# Altium schematic sheet UTHP Power Supply and PLC.SchDoc: Ultimate Truck Hacking Platform
size Letter; Author: Dr. Jeremy Daily; Organization: Systems Cyber Research Group; Address2: Thomas Balzer; Address3: Carson Green; DocumentNumber: Power, LIN, Logic Buffer; Revision: 1; SheetNumber: 4; SheetTotal: 6
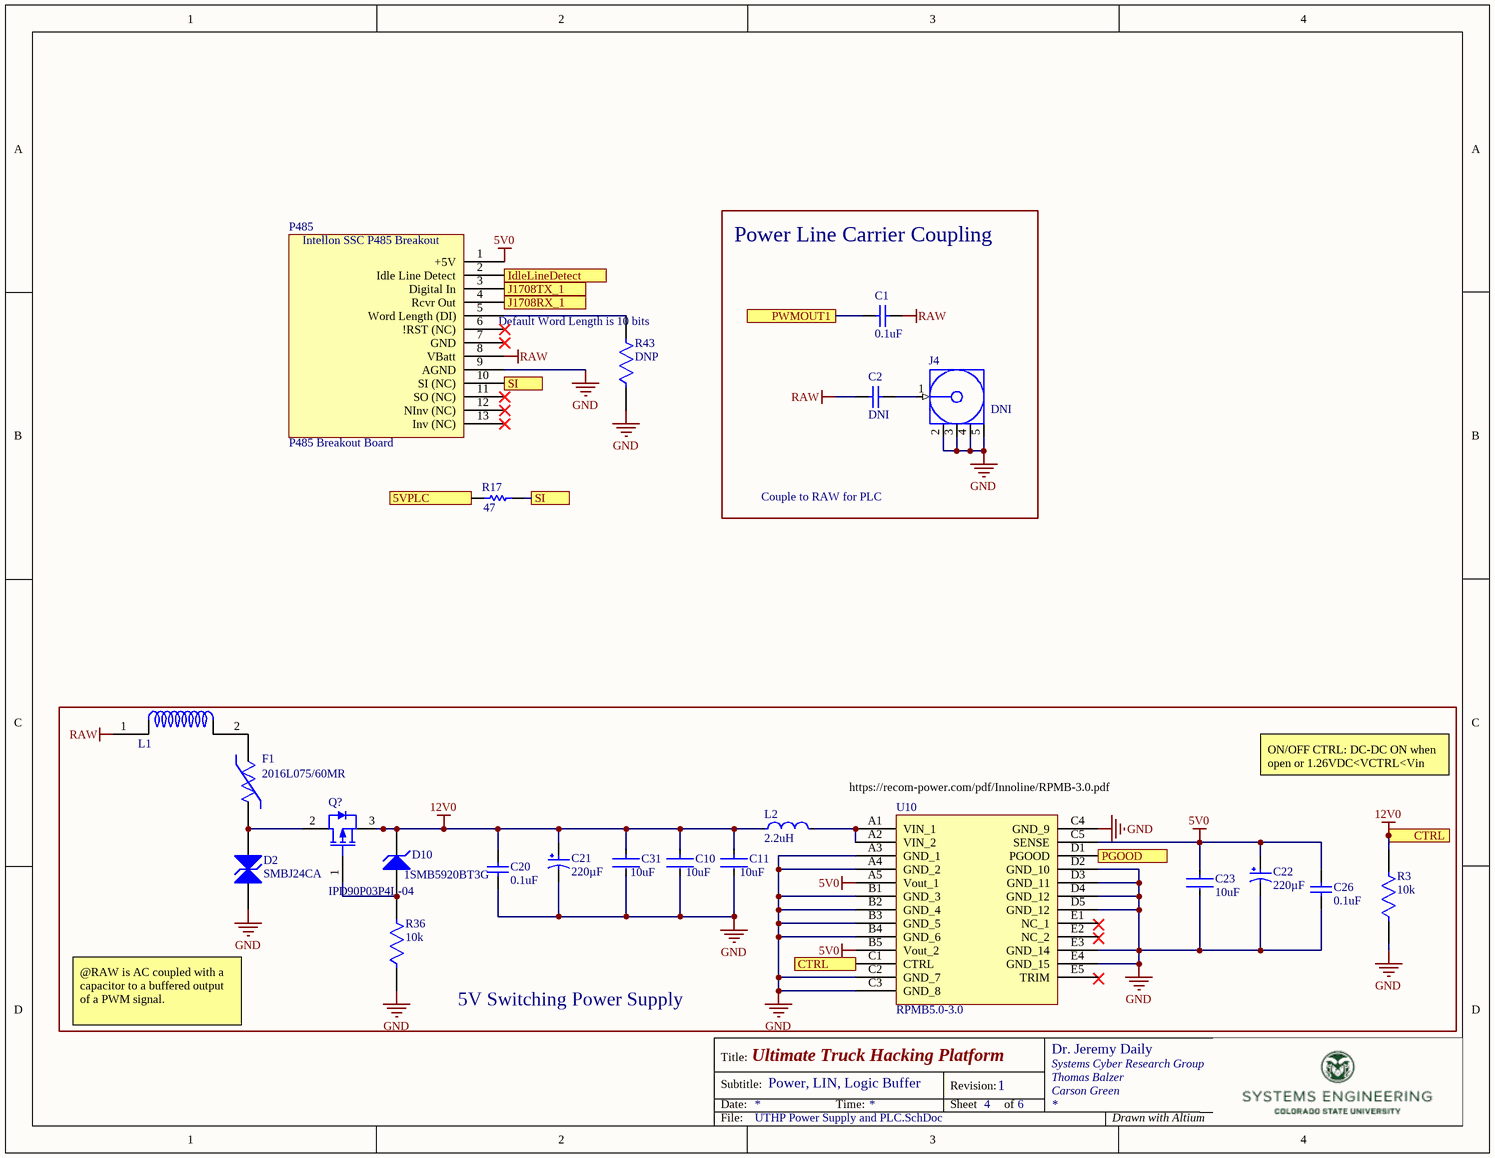
[diagram p0: UTHP Power Supply and PLC.SchDoc]

## Parts
C1  0.1uF  [CAPC1608X90X35LL15T15]
C2  DNI  [CAPC1608X90X35LL15T15]
C10  10uF  [FP-MK325A-MFG]
C11  10uF  [FP-MK325A-MFG]
C20  0.1uF  [CAPC1608X90X35LL15T15]
C21  value 220µF  [CAPPR65-500-1250X1000X1350]  (hidden comment: ECA-1HM221)
C22  value 220µF  [CAPPR65-500-1250X1000X1350]  (hidden comment: ECA-1HM221)
C23  10uF  [FP-MK325A-MFG]
C26  0.1uF  [CAPC1608X90X35LL15T15]
C31  10uF  [FP-MK325A-MFG]
D2  SMBJ24CA  [VISH-DO-214AA-A-2_V]
D10  1SMB5920BT3G  [ONSC-SMB-2-403A-03_H_V]
F1  2016L075/60MR  [FP-2016L075-60MR-MFG]
J4  DNI  [CON-SMA-SMD-RA]
L1  VSAB1770-560M  [VSAB1770-560M-Footprint-1]  (value not drawn)
L2  2.2uH  [FP-LQM2HPN_G0-IPC_C]
P485  P485 Breakout Board  [P485 Breakout Board-Footprint-1]
Q?  IPD90P03P4L-04  [INF-PG-TO252-3-11_M]
R3  10k  [FP-KTR03-IPC_B]
R17  47  [RESC1609X50X30LL10T20]
R36  10k  [FP-KTR03-IPC_B]
R43  DNP  [FP-KTR03-IPC_B]
U10  RPMB5.0-3.0  [New footprint 1]

## Blocks framed on the sheet
Power Line Carrier Coupling: C1 C2 J4
5V Switching Power Supply: C10 C11 C20-C23 C26 C31 D2 D10 F1 L1 L2 Q? R3 R36 U10

## Ports
5VPLC, CTRL, IdleLineDetect, J1708RX_1, J1708TX_1, PGOOD, PWMOUT1, SI

## Nets
5V0: C22.1 C23.1 C26.1 P485.1(+5V) U10.A5(Vout_1) U10.B5(Vout_2) U10.C5(SENSE)
12V0: C10.1 C11.1 C20.1 C21.1 C31.1 D10.1(K) L2.1 Q?.3(SOURCE) R3.2 U10.C1(CTRL) ; port CTRL
GND: C10.2 C11.2 C20.2 C21.2 C22.2 C23.2 C26.2 C31.2 D2.1(A) J4.2(GND) J4.3(GND) J4.4(GND) J4.5(GND) P485.9(AGND) R3.1 R36.1 R43.1 U10.A3(GND_1) U10.A4(GND_2) U10.B1(GND_3) U10.B2(GND_4) U10.B3(GND_5) U10.B4(GND_6) U10.C2(GND_7) U10.C3(GND_8) U10.C4(GND_9) U10.D2(GND_10) U10.D3(GND_11) U10.D4(GND_12) U10.D5(GND_12) U10.E3(GND_14) U10.E4(GND_15)
RAW: C1.1 C2.2 L1.1 P485.8(VBatt)
5VPLC: R17.1 ; port 5VPLC
IdleLineDetect: P485.2(Idle_Line_Detect) ; port IdleLineDetect
J1708RX_1: P485.4(Rcvr_Out) ; port J1708RX_1
J1708TX_1: P485.3(Digital_In) ; port J1708TX_1
PGOOD: U10.D1(PGOOD) ; port PGOOD
PWMOUT1: C1.2 ; port PWMOUT1
SI: P485.10(SI_(NC)) R17.2 ; port SI
NetC2_1: C2.1 J4.1(Signal)
NetD2_2: D2.2(A) F1.2 Q?.2(DRAIN)
NetD10_2: D10.2(A) Q?.1(GATE) R36.2
NetF1_1: F1.1 L1.2
NetL2_2: L2.2 U10.A1(VIN_1) U10.A2(VIN_2)
NetP485_5: P485.5(Word_Length_(DI)) R43.2

Not connected (* = marked no-connect by the designer): P485 6(!RST_(NC))* 7(GND)* 11(SO_(NC))* 12(NInv_(NC))* 13(Inv_(NC))*; U10 E1(NC_1) E2(NC_2) E5(TRIM)

## Notes on the sheet
- (near R43) Default Word Length is 10 bits
- Couple to RAW for PLC
- ON/OFF CTRL: DC-DC ON when open or 1.26VDC<VCTRL<Vin
- https://recom-power.com/pdf/Innoline/RPMB-3.0.pdf
- @RAW is AC coupled with a capacitor to a buffered output of a PWM signal.
- Title:
- Subtitle:
- Date:
- Time:
- Revision:
- Sheet
- of
- File:
- Drawn with Altium
- (in symbol CMP-002-00085-1) Intellon SSC P485 Breakout

## Library data of the parts
C1 C20 C26 = CMP-2006-04387-1: 0.1 µF ±10% 50V Ceramic Capacitor X7R 0603 (1608 Metric); Manufacturer: KYOCERA AVX; Part Number: KAM15AR71H104KM; Supplier 1: Digi-Key; Supplier Part Number 1: 478-KAM15AR71H104KMTR-ND; Value: 0.1uF
C2 = CMP-2006-04387-1: 0.1 µF ±10% 50V Ceramic Capacitor X7R 0603 (1608 Metric); Manufacturer: KYOCERA AVX; Part Number: KAM15AR71H104KM; Value: 0.1uF; Supplier 1: Digi-Key; Supplier Part Number 1: 478-KAM15AR71H104KMTR-ND
C10 C11 C31 = CMP-14477-002214-1: CAP CER 10UF 50V X7R 1210 UMK325AB7106KM-T; Manufacturer: Taiyo Yuden; Part Number: UMK325AB7106KM-T; Supplier 1: Digi-Key; Supplier Part Number 1: 587-3167-1-ND
C21 C22 = CMP-001-00028-7: 220 µF 50 V Aluminum Electrolytic Capacitors Radial, Can 2000 Hrs @ 85°C; Manufacturer: Panasonic; Part Number: ECA-1HM221; Supplier 1: Digi-Key; Supplier Part Number 1: P5183-ND
C23 = CMP-14477-002214-1: CAP CER 10UF 50V X7R 1210; Termination: SMD/SMT
D2 = CMP-2000-07094-1: 38.9V Clamp 15.4A Ipp Tvs Diode Surface Mount DO-214AA (SMBJ); Manufacturer: Vishay; Part Number: SMBJ24CA-E3/52; Supplier 1: Digi-Key; Supplier Part Number 1: SMBJ24CA-E3/52GICT-ND; Value: TVS Diode
D10 = CMP-1060-00222-1: 3 W Zener Voltage Regulator, 2-Pin SMB, Pb-Free, Tape and Reel; Manufacturer: On Semiconductor
F1 = CMP-08606-000082-1: PTC RESET FUSE 60V 750MA 2016; Manufacturer: LittelFuse Inc; Part Number: 2016L075/60MR; Supplier 1: Digi-Key; Supplier Part Number 1: F6800CT-ND; Value: Reset Fuse
J4 = CMP-0168-00021-1: SMA Female Right Angle Surface Mount Connector
L1 = CMP-006-00023-1: Automotive Molded Power Inductor
L2 = CMP-1662-00028-2: 2.2 µH Shielded Inductor 4 A 73mOhm Max 1210 (3225 Metric) Flat Wire; Manufacturer: Bourns Inc.; Part Number: SRP3212A-2R2M; Value: 2.2 µH; Supplier 1: Digi-Key; Supplier Part Number 1: 118-SRP3212A-2R2MTR-ND
P485 = CMP-002-00085-1: CSU Custom Breaklout for the Itellon SSC P485 breakout board with castlated edges that measures x by y/
Q? = CMP-1138-00142-1: OptiMOS-P2 Power-Transistor, -30 V VDS, -90 A ID, PG-TO252-3-11, Reel, Green; Manufacturer: Infineon; IDpuls (max): -360 A; RthJC (max): 1.1 K/W; VDS (max): -30 V; Ptot (max): 137 W; RDS (on) (max) (@4.5V): 6.8 mOhm; VGS(th) (min): -1 V; QG: 125 nC; Green: TRUE; ID (max): -90 A; VGS(th) (max): -2 V; RDS (on) (max) (@10V): 4.1 mOhm; ComponentLink3URL: http://www.infineon.com/dgdl/BTS142_DS_13.pdf?folderId=db3a3043163797a6011667aa084c0e01&fileId=db3a3043163797a6011667ac98be0e02&location=en.Products.Automotive_ICs.Smart_High-_and_Low-Side_Switches.HITFET___TEMPFET__-_Smart_Low-Side_Switches.DATASHEET.BTS1; ComponentLink3Description: Package Specification; Halogen-free: TRUE; Mounting Technology: Surface Mount; Packing: Reel; DatasheetVersion: Rev. 1.0; ComponentLink2URL: http://www.infineon.com/dgdl/IPD90P03P4L-04_DS_10.pdf?folderId=db3a304314dca3890114ef902baa05f9&fileId=db3a30431ddc9372011e07e8373a27c4&location=en.Products.Automotive_ICs.Automotive_MOSFETs.Single__P-Channel_30V_MOSFETs.DATASHEET.IPD90P03P4L-04_DS_10.pdf; PackageDescription: 3-Pin Plastic (Green) Transistor Single Outline Package, 6.5 x 6.12 mm Body, 2.28 mm Pitch; ComponentLink2Description: Datasheet; PackageVersion: Dec-06; ComponentLink1Description: Manufacturer URL; Technology: OptiMOS-P2; PackageReference: PG-TO252-3-11; PartNumber: IPD90P03P4L-04; ComponentLink1URL: http://www.infineon.com/
R3 R36 = CMP-08839-030382-1: 10 kOhms ±1% 0.1W, 1/10W Chip Resistor 0603 (1608 Metric) Automotive AEC-Q200, High Voltage Thick Film; Manufacturer: Rohm Semiconductor; Part Number: KTR03EZPF1002; Supplier 1: Digi-Key; Supplier Part Number 1: RHM10.0KAYCT-ND; Value: 10k
R17 = CMP-2000-03383-1: CRCW060347R0FKEA Res Thick Film 0603 47 Ohm 1% 1/10W ±100ppm/°C Molded SMD Paper T/R; Manufacturer: Vishay Dale; Part Number: CRCW060347R0FKEA; Supplier 1: Digi-Key; Supplier Part Number 1: 541-47.0HCT-ND; Value: 47
R43 = CMP-08839-030382-1: 10 kOhms ±1% 0.1W, 1/10W Chip Resistor 0603 (1608 Metric) Automotive AEC-Q200, High Voltage Thick Film; Manufacturer: Rohm Semiconductor; Part Number: KTR03EZPF1002; Value: 10k; Supplier 1: Digi-Key; Supplier Part Number 1: RHM10.0KAYCT-ND
U10 = CMP-001-0001-1: DC-DC Converter, Encapsulated, SMD, 5V@3A, 5.5-36V in, RPMB-3.0 Series